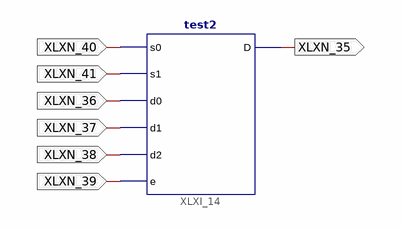
[diagram p0: schematic sheet 1]
// Xilinx ISE schematic test.sch (artix7) as structural Verilog: 1 symbols, 7 ports
module test (
  input  XLXN_36,
  input  XLXN_37,
  input  XLXN_38,
  input  XLXN_39,
  input  XLXN_40,
  input  XLXN_41,
  output XLXN_35
);

  test2 XLXI_14 (.D(XLXN_35), .d0(XLXN_36), .d1(XLXN_37), .d2(XLXN_38), .e(XLXN_39), .s0(XLXN_40), .s1(XLXN_41));
endmodule
